# Altium schematic sheet Microcontroller.SchDoc
size A3; SheetNumber: 2; SheetTotal: 4
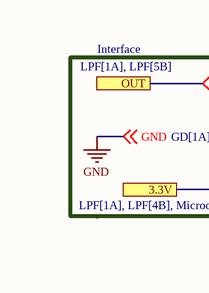
[diagram p0: Microcontroller.SchDoc, left]
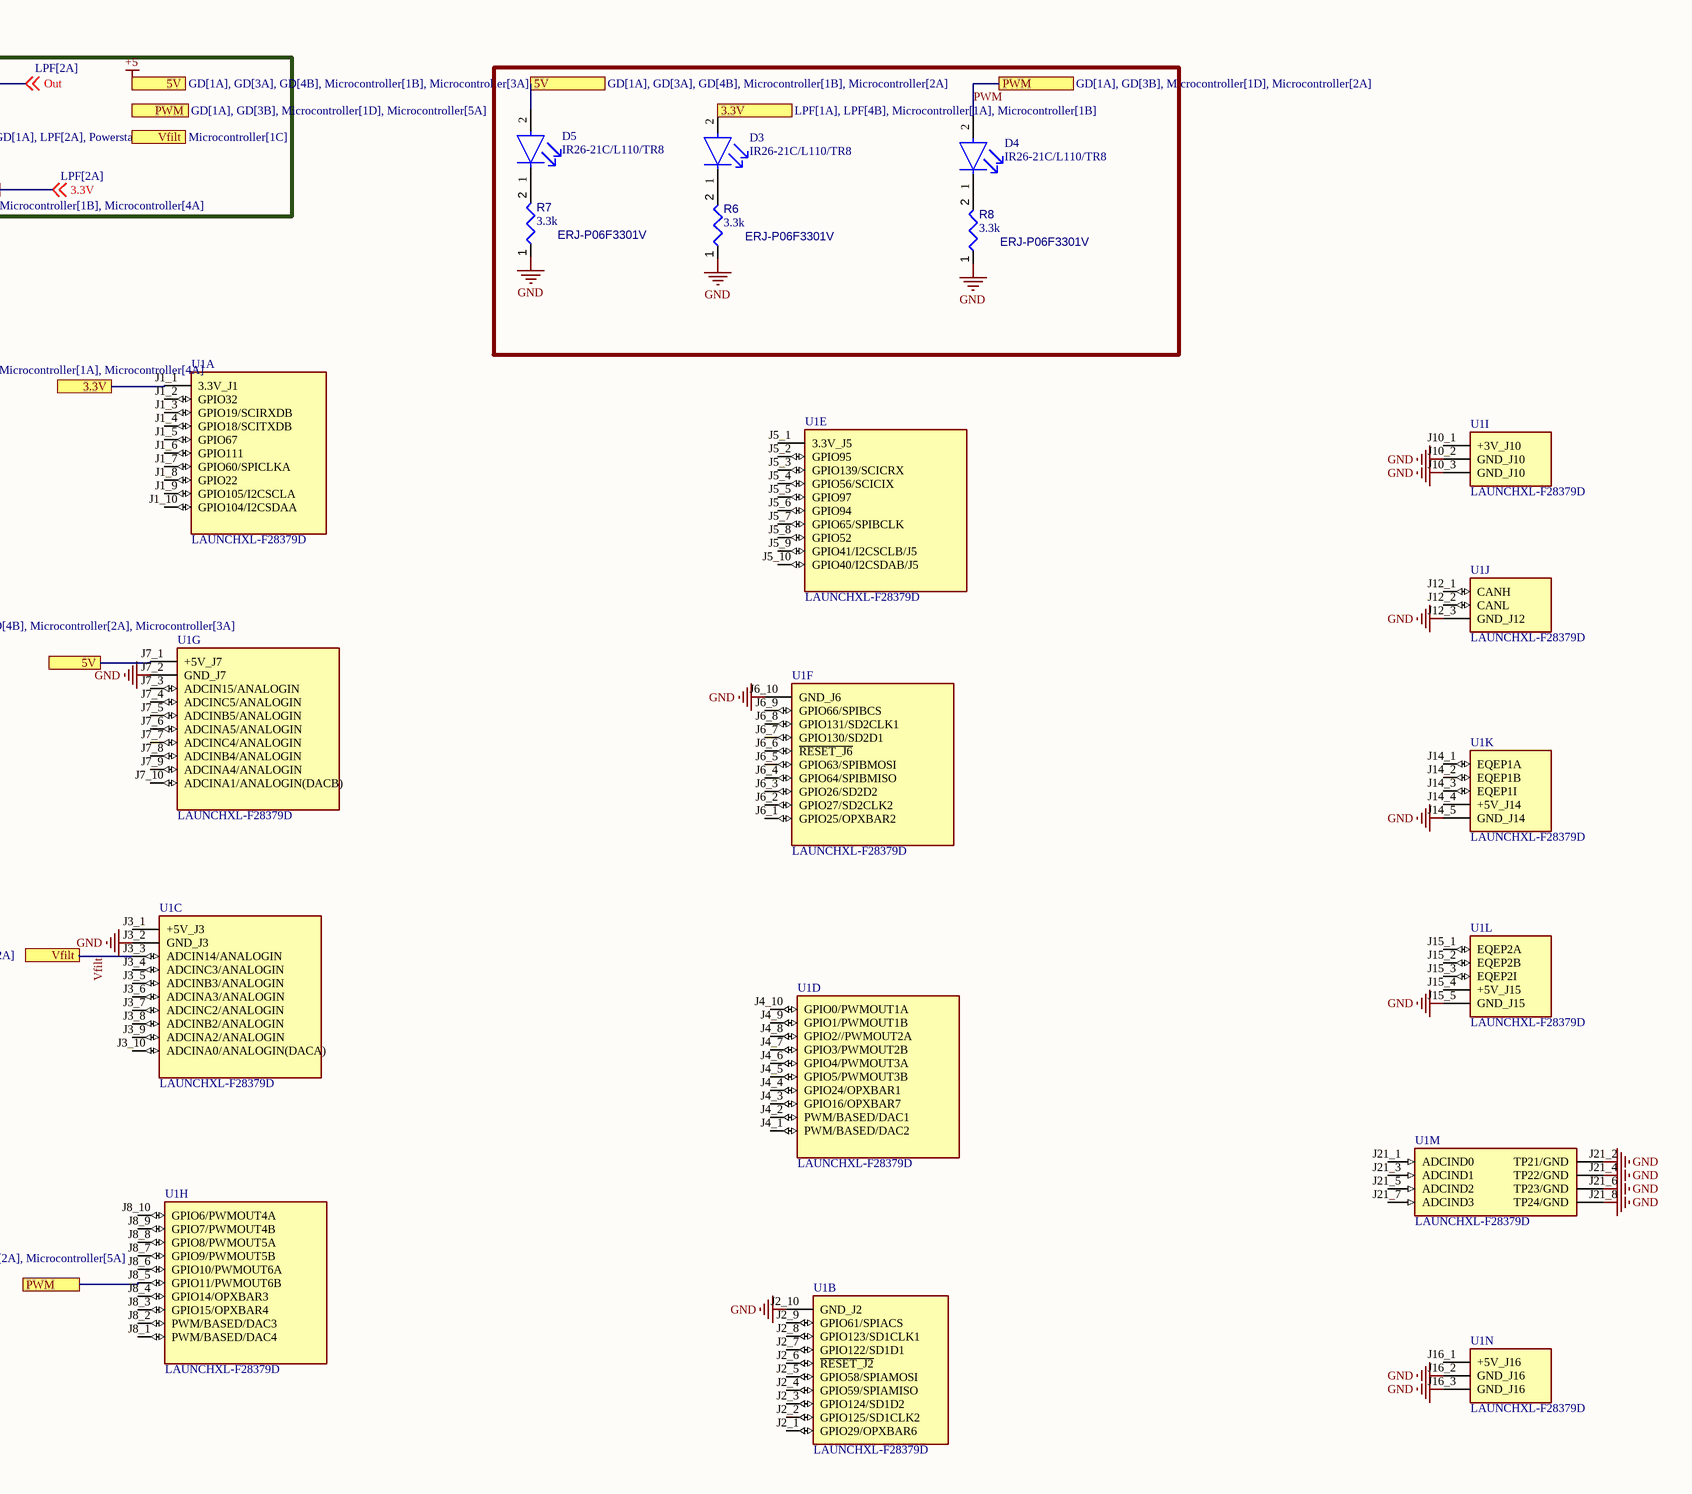
[diagram p1: Microcontroller.SchDoc, right]

## Parts
D3  IR26-21C/L110/TR8  [FP-APTD3216CGCK-MFG]
D4  IR26-21C/L110/TR8  [FP-APTD3216CGCK-MFG]
D5  IR26-21C/L110/TR8  [FP-APTD3216CGCK-MFG]
R6  ERJ-P06F3301V  value 3.3k  [RESC0805(2012)_L]
R7  ERJ-P06F3301V  value 3.3k  [RESC0805(2012)_L]
R8  ERJ-P06F3301V  value 3.3k  [RESC0805(2012)_L]
U1  LAUNCHXL-F28379D  [MOD_LAUNCHXL-F28379D]  (parts A,B,C,D,E,F,G,H,I,J,K,L,M,N of 14)

## Ports
3.3V (see LPF[1A], LPF[4B], Microcontroller[1A], Microcontroller[1B]), 3.3V (see LPF[1A], LPF[4B], Microcontroller[1A], Microcontroller[4A]), 3.3V (see LPF[1A], LPF[4B], Microcontroller[1B], Microcontroller[4A]), 5V (see GD[1A], GD[3A], GD[4B], Microcontroller[1B], Microcontroller[2A]), 5V (see GD[1A], GD[3A], GD[4B], Microcontroller[1B], Microcontroller[3A]), 5V (see GD[1A], GD[3A], GD[4B], Microcontroller[2A], Microcontroller[3A]), OUT (see LPF[1A], LPF[5B]), PWM (see GD[1A], GD[3B], Microcontroller[1D], Microcontroller[2A]), PWM (see GD[1A], GD[3B], Microcontroller[1D], Microcontroller[5A]), PWM (see GD[1A], GD[3B], Microcontroller[2A], Microcontroller[5A]), Vfilt (see Microcontroller[1C]), Vfilt (see Microcontroller[2A])

## Nets
+5: D5.2(A) U1.J7_1(+5V_J7) ; port 5V
GND: R6.1 R7.1 R8.1 U1.J2_10(GND_J2) U1.J3_2(GND_J3) U1.J6_10(GND_J6) U1.J7_2(GND_J7) U1.J10_2(GND_J10) U1.J10_3(GND_J10) U1.J12_3(GND_J12) U1.J14_5(GND_J14) U1.J15_5(GND_J15) U1.J16_2(GND_J16) U1.J16_3(GND_J16) U1.J21_2(TP21/GND) U1.J21_4(TP22/GND) U1.J21_6(TP23/GND) U1.J21_8(TP24/GND) ; off-sheet GND
3.3V: D3.2(A) U1.J1_1(3.3V_J1) ; off-sheet 3.3V, port 3.3V
Out: off-sheet Out, port OUT
PWM: D4.2(A) U1.J8_5(GPIO11/PWMOUT6B) ; port PWM
Vfilt: U1.J3_3(ADCIN14/ANALOGIN) ; port Vfilt
NetD3_1: D3.1(C) R6.2
NetD4_1: D4.1(C) R8.2
NetD5_1: D5.1(C) R7.2

Not connected (* = marked no-connect by the designer): U1 J1_2(GPIO32) J1_3(GPIO19/SCIRXDB) J1_4(GPIO18/SCITXDB) J1_5(GPIO67) J1_6(GPIO111) J1_7(GPIO60/SPICLKA) J1_8(GPIO22) J1_9(GPIO105/I2CSCLA) J1_10(GPIO104/I2CSDAA) J2_1(GPIO29/OPXBAR6) J2_2(GPIO125/SD1CLK2) J2_3(GPIO124/SD1D2) J2_4(GPIO59/SPIAMISO) J2_5(GPIO58/SPIAMOSI) J2_6(~{RESET_J2}) J2_7(GPIO122/SD1D1) J2_8(GPIO123/SD1CLK1) J2_9(GPIO61/SPIACS) J3_1(+5V_J3) J3_4(ADCINC3/ANALOGIN) J3_5(ADCINB3/ANALOGIN) J3_6(ADCINA3/ANALOGIN) J3_7(ADCINC2/ANALOGIN) J3_8(ADCINB2/ANALOGIN) J3_9(ADCINA2/ANALOGIN) J3_10(ADCINA0/ANALOGIN(DACA)) J4_1(PWM/BASED/DAC2) J4_2(PWM/BASED/DAC1) J4_3(GPIO16/OPXBAR7) J4_4(GPIO24/OPXBAR1) J4_5(GPIO5/PWMOUT3B) J4_6(GPIO4/PWMOUT3A) J4_7(GPIO3/PWMOUT2B) J4_8(GPIO2//PWMOUT2A) J4_9(GPIO1/PWMOUT1B) J4_10(GPIO0/PWMOUT1A) J5_1(3.3V_J5) J5_2(GPIO95) J5_3(GPIO139/SCICRX) J5_4(GPIO56/SCICIX) J5_5(GPIO97) J5_6(GPIO94) J5_7(GPIO65/SPIBCLK) J5_8(GPIO52) J5_9(GPIO41/I2CSCLB/J5) J5_10(GPIO40/I2CSDAB/J5) J6_1(GPIO25/OPXBAR2) J6_2(GPIO27/SD2CLK2) J6_3(GPIO26/SD2D2) J6_4(GPIO64/SPIBMISO) J6_5(GPIO63/SPIBMOSI) J6_6(~{RESET_J6}) J6_7(GPIO130/SD2D1) J6_8(GPIO131/SD2CLK1) J6_9(GPIO66/SPIBCS) J7_3(ADCIN15/ANALOGIN) J7_4(ADCINC5/ANALOGIN) J7_5(ADCINB5/ANALOGIN) J7_6(ADCINA5/ANALOGIN) J7_7(ADCINC4/ANALOGIN) J7_8(ADCINB4/ANALOGIN) J7_9(ADCINA4/ANALOGIN) J7_10(ADCINA1/ANALOGIN(DACB)) J8_1(PWM/BASED/DAC4) J8_2(PWM/BASED/DAC3) J8_3(GPIO15/OPXBAR4) J8_4(GPIO14/OPXBAR3) J8_6(GPIO10/PWMOUT6A) J8_7(GPIO9/PWMOUT5B) J8_8(GPIO8/PWMOUT5A) J8_9(GPIO7/PWMOUT4B) J8_10(GPIO6/PWMOUT4A) J10_1(+3V_J10) J12_1(CANH) J12_2(CANL) J14_1(EQEP1A) J14_2(EQEP1B) J14_3(EQEP1I) J14_4(+5V_J14) J15_1(EQEP2A) J15_2(EQEP2B) J15_3(EQEP2I) J15_4(+5V_J15) J16_1(+5V_J16) J21_1(ADCIND0) J21_3(ADCIND1) J21_5(ADCIND2) J21_7(ADCIND3)

## Notes on the sheet
- Interface

## Library data of the parts
D3-D5 = CMP-2000-05792-2: LED GREEN CLEAR 2SMD; Forward Voltage: 2.1V; Forward Current: 20mA; Luminous Intensity: 300mcd; Number of LEDs: 1; Dominant Wavelength: 570nm; Viewing Angle: 50°; Lead Free: Lead Free; Lens Color: Clear; Mount: Surface Mount; Package Quantity: 2000; Height: 1.8mm; Number of Pins: 2; Test Current: 20mA; Case Code (Metric): 3216; Case/Package: 1206; Case Code (Imperial): 1206; Illumination Color: Green; Color: Green; Width: 1.6mm; Packaging: Tape and Reel; Min Operating Temperature: -40°C; Lens Style: Clear; Max Operating Temperature: 85°C; Length: 3.2mm
R6-R8 = CMP-009-00076-5: 1K 0.125W 5% 0805 (2012 Metric)  SMD; Power: 125mW; Tolerance: 5%; Case/Package: 0805; Mounting Technology: SMT; Pins: 2
U1 = CMP-267-000000-2: C2000 Delfino MCU F28379D LaunchPadâ„¢ development kit WITH 3D BODY; MF: Texas Instruments; Pin Count: 107; MP: LAUNCHXL-F28379D; Design Item ID: LAUNCHXL-F28379D; Component Type: Standard; Availability: In Stock; SnapEDA_Link: https://www.snapeda.com/parts/LAUNCHXL-F28379D/Texas+Instruments/view-part/?ref=snap; Check_prices: https://www.snapeda.com/parts/LAUNCHXL-F28379D/Texas+Instruments/view-part/?ref=eda; Package: None; Value: *; Price: None; Purchase-URL: https://pricing.snapeda.com/search/part/LAUNCHXL-F28379D/?ref=eda; Source: LAUNCHXL-F28379D.SchLib